# EAGLE design cyberspace-1-rom-programmer (EAGLE 9.6.2)
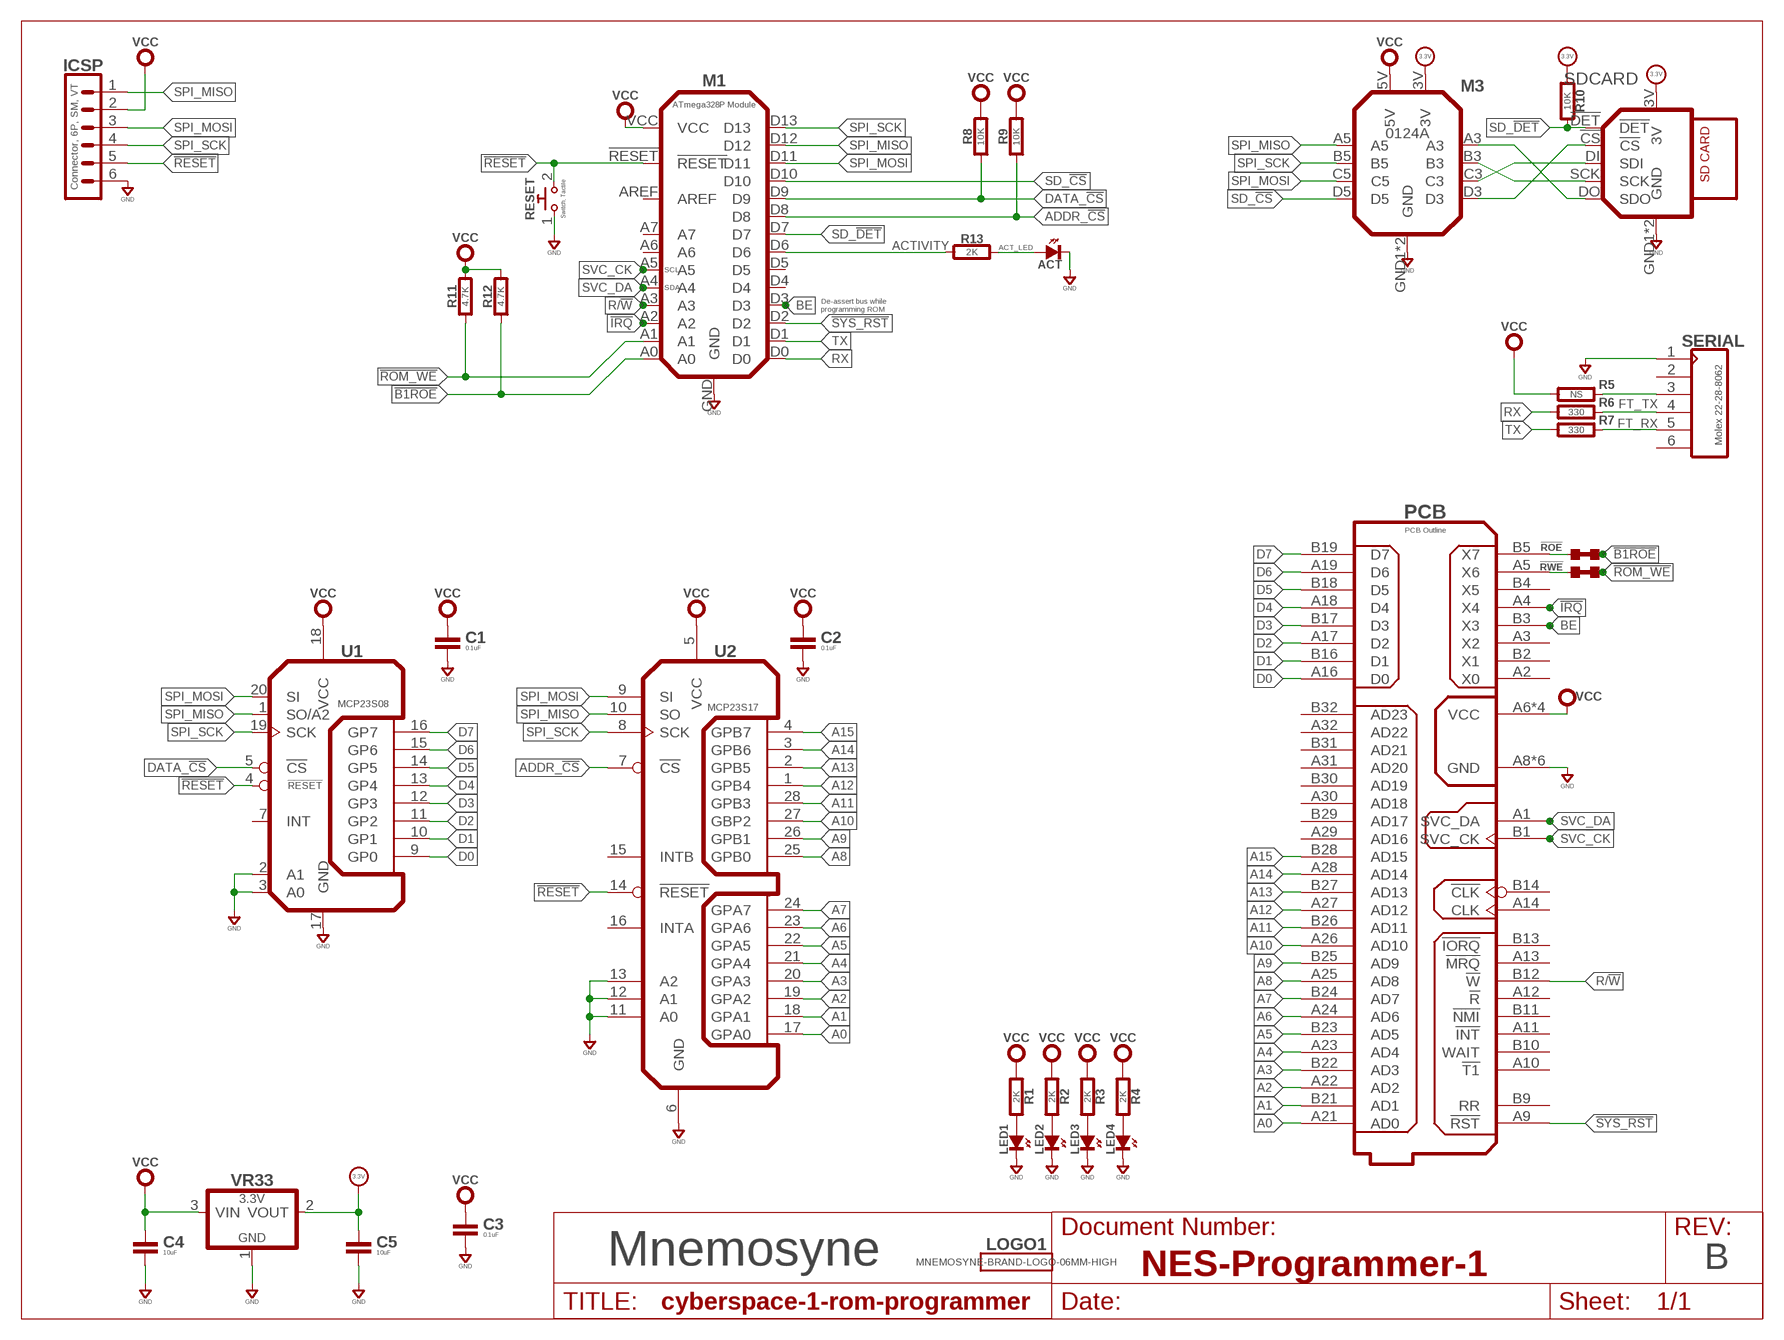
[diagram p0: schematic, sheet 1]
FRAME1 (LETTER_L): DOCUMENT_NUMBER: NES-Programmer-1; REV: B

## Parts
!ROE  NP  SHORT0603  [0603-SHORT]
!RWE  NP  SHORT0603  [0603-SHORT]
ACT  SMT0603  [SMD_0603]
C1  0.1uF  CAPACITOR0603  [0603-CAP]
C2  0.1uF  CAPACITOR0603  [0603-CAP]
C3  0.1uF  CAPACITOR0603  [0603-CAP]
C4  10uF  CAPACITOR0603  [0603-CAP]
C5  10uF  CAPACITOR0603  [0603-CAP]
ICSP  Connector, 6P, SM, VT  06P-SM-VT-SMT  [BM06B-SRSS-TB]
LED1  SMT0603  [SMD_0603]
LED2  SMT0603  [SMD_0603]
LED3  SMT0603  [SMD_0603]
LED4  SMT0603  [SMD_0603]
LOGO1  MNEMOSYNE-BRAND-LOGO-06MM-HIGH  [MNEMOSYNE-06MM]
M1  ATmega328P Module  0119REV-A  [0119A]
M3  0124A  0124REV-A  [0124A]
PCB  PCB Outline  CYBERSPACE-1-CARD-1A  [CYBERSPACE-CARD-TYPE-1A]
R1  2K  RESISTOR0603  [0603-RES]
R2  2K  RESISTOR0603  [0603-RES]
R3  2K  RESISTOR0603  [0603-RES]
R4  2K  RESISTOR0603  [0603-RES]
R5  NS  RESISTOR0603  [0603-RES]
R6  330  RESISTOR0603  [0603-RES]
R7  330  RESISTOR0603  [0603-RES]
R8  10K  RESISTOR0603  [0603-RES]
R9  10K  RESISTOR0603  [0603-RES]
R10  10K  RESISTOR0603  [0603-RES]
R11  4.7K  RESISTOR0603  [0603-RES]
R12  4.7K  RESISTOR0603  [0603-RES]
R13  2K  RESISTOR0603  [0603-RES]
RESET  Switch, Tactile  TACTILESPST-RA-6X6  [TC-0202]
SDCARD  0127REV-A  [0127A]
SERIAL  Molex 22-28-8062  CON_06X1-RA  [MA06X1-RA-THD]
U1  MCP23S08  MCP23S08-QFN  [QFN-20]
U2  MCP23S17  MCP23S17-QFN  [QFN-28-6X6]
VR33  3.3V  LDO-3P--3.3V-SOT23  [SOT-23]

## Nets
!B1ROE: !ROE.4 M1.A0 R12.1
!IRQ: M1.A2 PCB.A4(X4)
!RESET: ICSP.5 M1.!RESET RESET.2 U1.4(!RESET) U2.14(!RESET)
!ROM_WE: !RWE.4 M1.A1 R11.1
!SYS_RST: M1.D2 PCB.A9(!RST)
+3.3V: C5.1 M3.3V R10.2 SDCARD.3V VR33.2(VOUT) ; supply symbol labelled 3.3V
A0: PCB.A21(AD0) U2.17(GPA0)
A1: PCB.B21(AD1) U2.18(GPA1)
A2: PCB.A22(AD2) U2.19(GPA2)
A3: PCB.B22(AD3) U2.20(GPA3)
A4: PCB.A23(AD4) U2.21(GPA4)
A5: PCB.B23(AD5) U2.22(GPA5)
A6: PCB.A24(AD6) U2.23(GPA6)
A7: PCB.B24(AD7) U2.24(GPA7)
A8: PCB.A25(AD8) U2.25(GPB0)
A9: PCB.B25(AD9) U2.26(GPB1)
A10: PCB.A26(AD10) U2.27(GBP2)
A11: PCB.B26(AD11) U2.28(GPB3)
A12: PCB.A27(AD12) U2.1(GPB4)
A13: PCB.B27(AD13) U2.2(GPB5)
A14: PCB.A28(AD14) U2.3(GPB6)
A15: PCB.B28(AD15) U2.4(GPB7)
ACT_LED: ACT.A R13.2
ACTIVITY: M1.D6 R13.1
ADDR_!CS: M1.D8 R9.1 U2.7(!CS)
BE: M1.D3 PCB.B3(X3)
D0: PCB.A16(D0) U1.9(GP0)
D1: PCB.B16(D1) U1.10(GP1)
D2: PCB.A17(D2) U1.11(GP2)
D3: PCB.B17(D3) U1.12(GP3)
D4: PCB.A18(D4) U1.13(GP4)
D5: PCB.B18(D5) U1.14(GP5)
D6: PCB.A19(D6) U1.15(GP6)
D7: PCB.B19(D7) U1.16(GP7)
DATA_!CS: M1.D9 R8.1 U1.5(!CS)
FT_RX: R7.1 SERIAL.5
FT_TX: R6.1 SERIAL.4
GND: ACT.K(C) C1.2 C2.2 C3.2 C4.2 C5.2 ICSP.6 LED1.K(C) LED2.K(C) LED3.K(C) LED4.K(C) M1.GND M3.GND1(GND) M3.GND2(GND) PCB.A8(GND) PCB.A15(GND) PCB.A20(GND) PCB.B8(GND) PCB.B15(GND) PCB.B20(GND) RESET.1 SDCARD.GND1(GND) SDCARD.GND2(GND) SERIAL.1 U1.2(A1) U1.3(A0) U1.17(GND) U2.6(GND) U2.11(A0) U2.12(A1) U2.13(A2) VR33.1(GND)
N$1: M3.A3 SDCARD.DO(SDO)
N$2: M3.B3 SDCARD.SCK
N$3: M3.C3 SDCARD.DI(SDI)
N$4: R5.1 SERIAL.3
N$5: M3.D3 SDCARD.!CS
N$6: LED1.A R1.2
N$7: LED2.A R2.2
N$8: LED3.A R3.2
N$9: !ROE.3 PCB.B5(X7)
N$10: !RWE.3 PCB.A5(X6)
N$11: LED4.A R4.2
R/!W: M1.A3 PCB.B12(!W)
RX: M1.D0 R6.2
SD_!CS: M1.D10 M3.D5
SD_!DET: M1.D7 R10.1 SDCARD.!DET
SPI_MISO: ICSP.1 M1.D12 M3.A5 U1.1(SO/A2) U2.10(SO)
SPI_MOSI: ICSP.3 M1.D11 M3.C5 U1.20(SI) U2.9(SI)
SPI_SCK: ICSP.4 M1.D13 M3.B5 U1.19(SCK) U2.8(SCK)
SVC_CK: M1.A5 PCB.B1(SVC_CK)
SVC_DA: M1.A4 PCB.A1(SVC_DA)
TX: M1.D1 R7.2
VCC: C1.1 C2.1 C3.1 C4.1 ICSP.2 M1.VCC M3.5V PCB.A6(VCC) PCB.A7(VCC) PCB.B6(VCC) PCB.B7(VCC) R1.1 R2.1 R3.1 R4.1 R5.2 R8.2 R9.2 R11.2 R12.2 U1.18(VCC) U2.5(VCC) VR33.3(VIN)
Unconnected: M1.A6 M1.A7 M1.AREF M1.D4 M1.D5 PCB.A2(X0) PCB.A3(X2) PCB.A10(!T1) PCB.A11(!INT) PCB.A12(!R) PCB.A13(!MRQ) PCB.A14(CLK) PCB.A29(AD16) PCB.A30(AD18) PCB.A31(AD20) PCB.A32(AD22) PCB.B2(X1) PCB.B4(X5) PCB.B9(RR) PCB.B10(WAIT) PCB.B11(!NMI) PCB.B13(!IORQ) PCB.B14(!CLK) PCB.B29(AD17) PCB.B30(AD19) PCB.B31(AD21) PCB.B32(AD23) SERIAL.2 SERIAL.6 U1.7(INT) U2.15(INTB) U2.16(INTA)

## Notes on the sheet
- SCL
- SDA
- De-assert bus while 
  programming ROM
- Mnemosyne

## Library data of the parts
!ROE !RWE = rlc:SHORT: Pre-shorted SMT Resistor Pad
ACT LED1-LED4 = led:SMT: LED SMT; COST01: 0.20; COST10: 0.17; COST100: 0.14
C1-C5 = rlc:CAPACITOR: Capacitor; COST01: 0.12; COST10: 0.09; COST100: 0.05
ICSP = con-jst:06P: Connector, 6P; COST01: 0.60; COST10: 0.52; COST100: 0.49; MFR: JST; MPN: BM06-SRSS-TB
LOGO1 = gfx-glyphs:MNEMOSYNE-BRAND-LOGO: Mnemosyne Brand Logo
M1 = circuit-monkey-chips:0119: Circuit Monkey #0119 - ATmega328P Module; COST01: 18.38; COST10: 13.22; COST100: 9.09; MFR: Circuit Monkey; MPN: 0119A
M3 = circuit-monkey-chips:0124: Logic Level Translator; COST01: 5.17; COST10: 3.60; COST100: 1.86; MFR: Circuit Monkey; MPN: 0124A
PCB = con-edge:CYBERSPACE-1-CARD: Card for the CyberSpace 1 System
R1-R13 = rlc:RESISTOR: Resistor; COST01: 0.10; COST10: 0.05; COST100: 0.02
RESET = switch-thd:TACTILE: Push Sw.; COST01: 0.20; COST10: 0.16; COST100: 0.13; MFR: CUI; MPN: TS11-674-xx; MPN2: Tayda/A-5134
SDCARD = circuit-monkey-chips:0127: 0127 SD Card Micro; COST01: 8.23; COST10: 5.24; COST100: 4.02; MFR: Circuit Monkey; MPN: 0127
SERIAL = con-headers:CON_06X1: Header, 6-pin, single row; COST01: 0.30; COST10: 0.20; COST100: 0.10
U1 = co-microchip:MCP23S08: Microchip 8-bit SPI I/O Expander; COST01: 1.65; COST10: 1.65; COST100: 1.32; MFR: Microchip; MPN: MCP23S08-E/ML
U2 = co-microchip:MCP23S17: 16-Bit I/O Expander with SPI Interface; COST01: 2.20; COST10: 2.10; COST100: 1.70; MFR: Microchip; MPN: MCP23S17-x/ML
VR33 = regulators:LDO-3P-: regulator 3-pin; COST01: 0.76; COST10: 0.66; COST100: 0.55; MPN: AP2120N-3.3; MPN2: XC6206P332MR-G; MPN3: AP7387-33SA; SEEED: 310030099

## Board
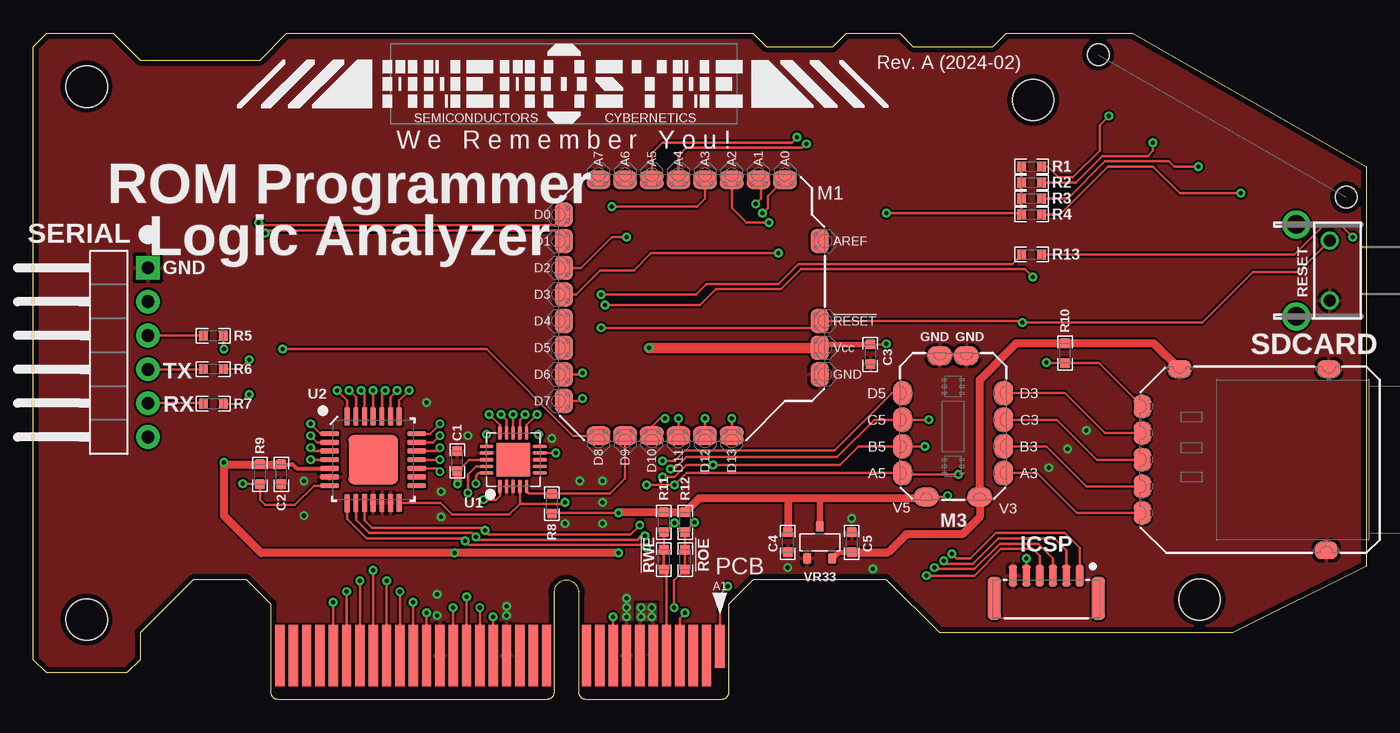
[diagram p1: board, top side]
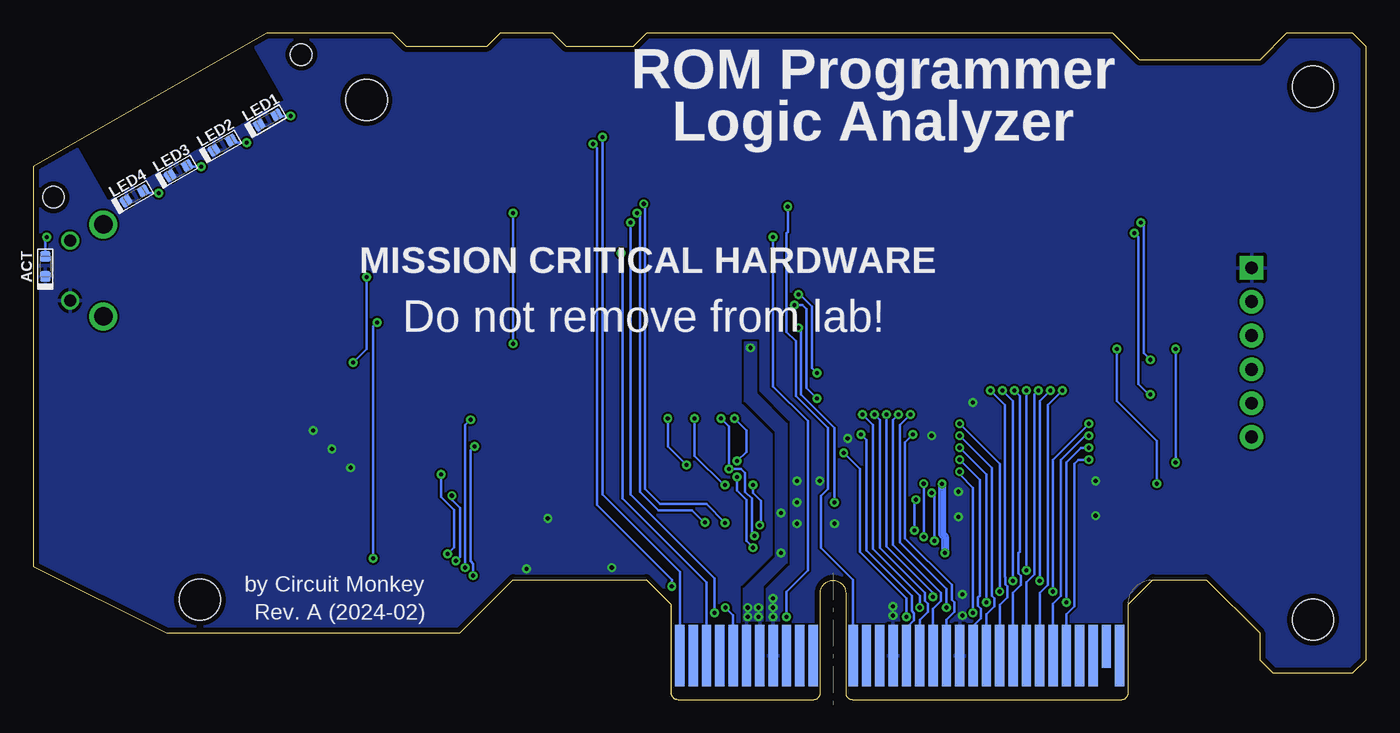
[diagram p2: board, bottom side, seen from below]

Size 100 x 50 mm. Coordinates in mm from the lower left corner, seen from the top.
Copper layers (1*16): Top 0.0356mm / dielectric 1.5011mm / Bottom 0.0356mm
Design rules "OSH-CircuitMonkey": minimum track width 6mil, minimum drill 12mil, track to track 6mil, track to pad 6mil, pad to pad 6mil, via to via 6mil, smd to smd 6mil, copper to edge 15mil, drill to drill 6mil, minimum pad ring 7mil, minimum via ring 7mil, stop-mask expansion 3mil, vias tented up to drill 13mil, thermal gap 10mil
Holes 1.6 mm at 79.9,48.4 98.5,37.7
bRestrict: area 81.3,37.6 to 96.6,48.9

### Footprints (pad centres in the part's own frame; a part is rotated, then mirrored left to right if it is on the bottom)
0603-SHORT = smd 0.711 x 0.762: 3 -0.752,0; 4 0.752,0
SMD_0603 = smd 0.8 x 0.8: A 0.75,0; K -0.75,0
0603-CAP = smd 0.711 x 0.762: 1 -0.752,0; 2 0.752,0
BM06B-SRSS-TB = smd 0.6 x 1.6: 1 -2.5,-0.3; 2 -1.5,-0.3; 3 -0.5,-0.3; 4 0.5,-0.3; 5 1.5,-0.3; 6 2.5,-0.3 | smd 1 x 3.2: MTG1 3.9,1.4; MTG2 -3.9,1.4
0119A = smd 1.4 x 1.8: !RESET 9.6,-1; AREF 9.6,5; D0 -9.6,7; D1 -9.6,5; D2 -9.6,3; D3 -9.6,1; D4 -9.6,-1; D5 -9.6,-3; D6 -9.6,-5; D7 -9.6,-7; GND 9.6,-5; VCC 9.6,-3 | smd 1.8 x 1.4: A0 7,9.6; A1 5,9.6; A2 3,9.6; A3 1,9.6; A4 -1,9.6; A5 -3,9.6; A6 -5,9.6; A7 -7,9.6; D8 -7,-9.6; D9 -5,-9.6; D10 -3,-9.6; D11 -1,-9.6; D12 1,-9.6; D13 3,-9.6
0124A = smd 1.8 x 1.4: 3V -2,5.3; 5V 2,5.3; GND1 -1,-5.3; GND2 1,-5.3 | smd 1.4 x 1.8: A3 -3.8,3.5; A5 3.8,3.5; B3 -3.8,1.5; B5 3.8,1.5; C3 -3.8,-0.5; C5 3.8,-0.5; D3 -3.8,-2.5; D5 3.8,-2.5
CYBERSPACE-CARD-TYPE-1A = smd 0.7 x 3.2: A1 11.5,4 | smd 0.7 x 4.6: A2 10.5,3.3; A3 9.5,3.3; A4 8.5,3.3; A5 7.5,3.3; A6 6.5,3.3; A7 5.5,3.3; A8 4.5,3.3; A9 3.5,3.3; A10 2.5,3.3; A11 1.5,3.3; A12 -1.5,3.3; A13 -2.5,3.3; A14 -3.5,3.3; A15 -4.5,3.3; A16 -5.5,3.3; A17 -6.5,3.3; A18 -7.5,3.3; A19 -8.5,3.3; A20 -9.5,3.3; A21 -10.5,3.3; A22 -11.5,3.3; A23 -12.5,3.3; A24 -13.5,3.3; A25 -14.5,3.3; A26 -15.5,3.3; A27 -16.5,3.3; A28 -17.5,3.3; A29 -18.5,3.3; A30 -19.5,3.3; A31 -20.5,3.3; A32 -21.5,3.3 | smd 0.7 x 4.6 bottom: B1 11.5,3.3; B2 10.5,3.3; B3 9.5,3.3; B4 8.5,3.3; B5 7.5,3.3; B6 6.5,3.3; B7 5.5,3.3; B8 4.5,3.3; B9 3.5,3.3; B10 2.5,3.3; B11 1.5,3.3; B12 -1.5,3.3; B13 -2.5,3.3; B14 -3.5,3.3; B15 -4.5,3.3; B16 -5.5,3.3; B17 -6.5,3.3; B18 -7.5,3.3; B19 -8.5,3.3; B20 -9.5,3.3; B21 -10.5,3.3; B22 -11.5,3.3; B23 -12.5,3.3; B24 -13.5,3.3; B25 -14.5,3.3; B26 -15.5,3.3; B27 -16.5,3.3; B28 -17.5,3.3; B29 -18.5,3.3; B30 -19.5,3.3; B32 -21.5,3.3 | smd 0.7 x 3.2 bottom: B31 -20.5,4 | hole 3.1: -36,46; -36,6; 47.5,7.5; 35,45
0603-RES = smd 0.711 x 0.762: 1 -0.752,0; 2 0.752,0
TC-0202 = drill 0.9: 1 -2.25,2.35; 2 2.25,2.35 | drill 1.4: MT1 -3.45,4.85; MT2 3.45,4.85
0127A = smd 1.7 x 1.3: 3V -6,6.8; GND1 5.2,6.8; GND2 5,-6.8 | smd 1.3 x 1.7: !CS -8.8,2; !DET -8.8,4; DI -8.8,0; DO -8.8,-4; SCK -8.8,-2
MA06X1-RA-THD = drill 0.965 pad 1.778 square: 1 0,0 | drill 0.965 pad 1.778: 2 2.54,0; 3 5.08,0; 4 7.62,0; 5 10.16,0; 6 12.7,0
QFN-20 = smd 1 x 0.25: 1 -2,1; 2 -2,0.5; 3 -2,0; 4 -2,-0.5; 5 -2,-1; 11 2,-1; 12 2,-0.5; 13 2,0; 14 2,0.5; 15 2,1 | smd 0.25 x 1: 6 -1,-2; 7 -0.5,-2; 8 0,-2; 9 0.5,-2; 10 1,-2; 16 1,2; 17 0.5,2; 18 0,2; 19 -0.5,2; 20 -1,2 | smd 2.5 x 2.5: PAD 0,0
QFN-28-6X6 = smd 3.7 x 3.7: 0 0,0 | smd 1.4 x 0.4: 1 -3.258,1.95; 2 -3.258,1.3; 3 -3.258,0.65; 4 -3.258,0; 5 -3.258,-0.65; 6 -3.258,-1.3; 7 -3.258,-1.95; 15 3.258,-1.95; 16 3.258,-1.3; 17 3.258,-0.65; 18 3.258,0; 19 3.258,0.65; 20 3.258,1.3; 21 3.258,1.95 | smd 0.4 x 1.4: 8 -1.95,-3.279; 9 -1.3,-3.258; 10 -0.65,-3.258; 11 0,-3.258; 12 0.65,-3.258; 13 1.3,-3.258; 14 1.95,-3.258; 22 1.95,3.258; 23 1.3,3.258; 24 0.65,3.258; 25 0,3.258; 26 -0.65,3.258; 27 -1.3,3.258; 28 -1.95,3.258
SOT-23 = smd 0.6 x 0.8: 1 0.95,1.2; 2 -0.95,1.2; 3 0,-1.2

### Placement (x,y rotation side)
!ROE  48.9,10.5 90 top
!RWE  47.3,10.5 90 top
ACT  99.1,32.5 90 bottom
C1  31.8,17.9 90 top
C2  18.6,16.9 270 top
C3  62.8,25.9 270 top
C4  56.6,11.8 270 top
C5  61.4,11.8 90 top
ICSP  76,9 180 top
LED1  82.4,43.5 30 bottom
LED2  85.8,41.6 30 bottom
LED3  89.1,39.7 30 bottom
LED4  92.4,37.8 30 bottom
LOGO1  39.8,46.2 0 top
M1  49.4,29.4 0 top
M3  69,20.5 180 top
PCB  40,0 0 top
R1  74.9,40 0 top
R2  74.9,38.8 0 top
R3  74.9,37.6 0 top
R4  74.9,36.4 0 top
R5  13.5,27.3 0 top
R6  13.5,24.8 0 top
R7  13.5,22.2 0 top
R8  38.9,14.7 270 top
R9  17,16.9 90 top
R10  77.4,26 90 top
R11  47.3,13.3 90 top
R12  48.9,13.3 90 top
R13  74.9,33.4 0 top
RESET  99.6,32.2 90 top
SDCARD  92,18 0 top
SERIAL  8.6,32.4 270 top
U1  36,18 90 top
U2  25.5,18 0 top
VR33  59,11.8 180 top

### Tracks (layer width: path | path; a pad name or v marks a point on that pad's centre or on a via)
!B1ROE  (via drill 0.3)
  Top 0.2: M1.A0 56.3,39 55.1,37.8 55.1,36.9 v54.7,36.5 | v49.6,13.3 49.6,13.25 R12.1 !ROE.4
  Bottom 0.2: v54.7,36.5 54.5,36.3 54.5,15.6 53.1,14.2 50.6,14.2 49.7,13.3 v49.6,13.3
!IRQ  (via drill 0.3)
  Top 0.2: PCB.A4 48.5,6.1 v48.9,6.5 | v55.2,35.8 53.5,35.8 52.4,36.9 M1.A2
  Bottom 0.2: v48.9,6.5 48.9,9.1 55.2,15.4 v55.2,35.8
!RESET  (via drill 0.3)
  Top 0.2: ICSP.5 v74.5,10.6 | RESET.2 94.9,32.1 91.5,32.1 87.7,28.3 v74.2,28.3 74.1,28.4 M1.!RESET 58.5,27.9 v42.6,27.9 | U2.14 30.56,14.74 31.4,13.9 35.7,13.9 36.5,14.7 | v39.9,14.8 39.8,14.7 36.5,14.7 | U1.4 36.5,14.7
  Bottom 0.2: v74.2,28.3 74.5,28 v74.5,10.6 | v39.9,14.8 39.9,20.4 42.4,22.9 42.4,27.7 v42.6,27.9
!ROM_WE  (via drill 0.3)
  Top 0.2: M1.A1 54.6,38.8 54.6,37.6 v54.2,37.2 | v48.1,13.25 47.35,12.55 R11.1 !RWE.4
  Bottom 0.2: v54.2,37.2 54.1,37.1 54.1,15.8 53,14.7 49.5,14.7 v48.1,13.25
!SYS_RST  (via drill 0.3)
  Top 0.2: PCB.A9 v43.5,6.2 | M1.D2 41.1,32.4 43.4,34.7 v44.5,34.7
  Bottom 0.2: v43.5,6.2 43.5,8.1 41.9,9.7 41.9,20.9 44.5,23.5 v44.5,34.7
+3.3V
  Top 0.4: VR33.2 60.4,11.05 C5.1
  Top 0.6: C5.1 64.15,11.05 65.5,12.4 69.7,12.4 71,13.7 M3.3V 71,24 73.75,26.75 R10.2 84.05,26.75 SDCARD.3V
A0  (via drill 0.3)
  Top 0.2: PCB.A21 v29.5,6.5 | U2.17 30.25,17.35 v30.5,17.1
  Bottom 0.2: v29.5,6.5 29.5,15.9 30.5,16.9 v30.5,17.1
A1  (via drill 0.3)
  Top 0.2: U2.18 v30.5,18
  Bottom 0.2: v30.5,18 29,16.5 29,7.8 29.15,7.65 29.15,7.05 28.9,6.8 28.9,6.1 29.5,5.5 PCB.B21
A2  (via drill 0.3)
  Top 0.2: PCB.A22 v28.5,7.3 | U2.19 30.25,18.65 v30.5,18.9
  Bottom 0.2: v28.5,7.3 28.5,16.9 v30.5,18.9
A3  (via drill 0.3)
  Top 0.2: U2.20 30,19.3 v30.5,19.8
  Bottom 0.2: PCB.B22 28.5,6.4 27.9,7 27.9,7.6 28.1,7.8 28.1,17.4 v30.5,19.8
A4  (via drill 0.3)
  Top 0.2: PCB.A23 v27.5,8.1 | U2.21 29.75,19.95 v30.5,20.7
  Bottom 0.2: v27.5,8.1 27.5,17.7 v30.5,20.7
A5  (via drill 0.3)
  Top 0.2: U2.22 27.45,22.45 v28.2,23.2
  Bottom 0.2: v28.2,23.2 27.1,22.1 27.1,9.2 27.08,9.18 27.08,8.66 26.92,8.49 26.92,7.68 27.5,7.1 PCB.B23
A6  (via drill 0.3)
  Top 0.2: PCB.A24 v26.5,8.9 | U2.23 26.8,22.7 v27.3,23.2
  Bottom 0.2: v26.5,8.9 26.5,22.4 v27.3,23.2
A7  (via drill 0.3)
  Top 0.2: U2.24 26.15,22.95 v26.4,23.2
  Bottom 0.2: PCB.B24 26.5,8 25.9,8.6 25.9,9.28 26.08,9.46 26.08,10.08 26.1,10.1 26.1,11 26,11.1 26,22.8 v26.4,23.2
A8  (via drill 0.3)
  Top 0.2: PCB.A25 v25.5,9.7 | U2.25 v25.5,23.2
  Bottom 0.2: v25.5,9.7 v25.5,23.2
A9  (via drill 0.3)
  Top 0.2: U2.26 24.85,22.95 v24.6,23.2
  Bottom 0.2: PCB.B25 25.5,8.8 24.9,9.4 24.9,22.9 v24.6,23.2
A10  (via drill 0.3)
  Top 0.2: PCB.A26 v24.5,8.9 | U2.27 24.2,22.7 v23.7,23.2
  Bottom 0.2: v24.5,8.9 24.5,22.4 v23.7,23.2
A11  (via drill 0.3)
  Top 0.2: U2.28 23.55,22.45 v22.8,23.2
  Bottom 0.2: PCB.B26 24.5,8 23.9,8.6 23.9,22.1 v22.8,23.2
A12  (via drill 0.3)
  Top 0.2: PCB.A27 v23.5,8.1 | U2.1 21.55,19.95 v20.8,20.7
  Bottom 0.2: v23.5,8.1 23.5,18 v20.8,20.7
A13  (via drill 0.3)
  Top 0.2: U2.2 21.3,19.3 v20.8,19.8
  Bottom 0.2: PCB.B27 23.5,7.2 22.9,7.8 22.9,18 21.1,19.8 v20.8,19.8
A14  (via drill 0.3)
  Top 0.2: PCB.A28 v22.5,7.3 | U2.3 21.05,18.65 v20.8,18.9
  Bottom 0.2: v22.5,7.3 22.5,17.8 21.4,18.9 v20.8,18.9
A15  (via drill 0.3)
  Top 0.2: U2.4 v20.8,18
  Bottom 0.2: PCB.B28 22.5,6.4 21.9,7 21.9,17.7 21.6,18 v20.8,18
ACT_LED  (via drill 0.3)
  Top 0.2: v99,34.7 98.1,35.6 96.8,35.6 94.6,33.4 R13.2
  Bottom 0.2: ACT.A 99.1,34.6 v99,34.7
ACTIVITY  (via drill 0.3)
  Top 0.2: M1.D6 41.1,24.4 v41.2,24.5 | v42.6,30.4 49.7,30.4 50.5,31.2 55.9,31.2 57.4,32.7 73.45,32.7 R13.1
  Bottom 0.2: v42.6,30.4 42.5,30.4 41.6,29.5 41.6,24.9 v41.2,24.5
ADDR_!CS  (via drill 0.3)
  Top 0.2: M1.D8 40.5,19.8 34,26.3 v18.7,26.3 | v15.7,16.2 16.95,16.2 R9.1 17,15 17.4,14.6 19.6,14.6 21.05,16.05 U2.7
  Bottom 0.2: v18.7,26.3 18.7,22.4 15.7,19.4 v15.7,16.2
BE  (via drill 0.3)
  Top 0.2: v55.9,33.5 46.35,33.5 45.05,32.2 42.5,32.2 40.7,30.4 M1.D3
  Bottom 0.2: PCB.B3 49.5,8.8 55.8,15.1 55.8,33.4 v55.9,33.5
D0  (via drill 0.3)
  Top 0.2: PCB.A16 v34.5,6.2 | U1.9 v39.2,18.5
  Bottom 0.2: v34.5,6.2 34.5,7.6 38,11.1 38,17.3 v39.2,18.5
D1  (via drill 0.3)
  Top 0.2: v37.9,19.9 38,19.8 U1.10
  Bottom 0.2: PCB.B16 34.5,5.38 33.92,5.96 33.92,6.47 34.1,6.65 34.1,7.8 37.5,11.2 37.5,19.5 v37.9,19.9
D2  (via drill 0.3)
  Top 0.2: PCB.A17 v33.5,6.9 | U1.11 37,20.6 v37.8,21.4
  Bottom 0.2: v33.5,6.9 33.5,7.8 37,11.3 37,20.6 v37.8,21.4
D3  (via drill 0.3)
  Top 0.2: U1.12 36.5,21 v36.9,21.4
  Bottom 0.2: PCB.B17 33.5,6 32.9,6.6 32.9,7.2 33.1,7.4 33.1,8 36.5,11.4 36.5,20.98 36.9,21.38 v36.9,21.4
D4  (via drill 0.3)
  Top 0.2: PCB.A18 v32.5,7.7 | U1.13 v36,21.4
  Bottom 0.2: v32.5,7.7 32.5,8 36,11.5 v36,21.4
D5  (via drill 0.3)
  Top 0.2: U1.14 35.5,21 v35.1,21.4
  Bottom 0.2: PCB.B18 32.5,6.8 31.9,7.4 31.9,8 35.5,11.6 35.5,21 v35.1,21.4
D6  (via drill 0.3)
  Top 0.2: PCB.A19 v31.5,6.9 | U1.15 35,20.6 v34.2,21.4
  Bottom 0.2: v34.2,21.4 35,20.6 35,11.8 31.5,8.3 v31.5,6.9
D7  (via drill 0.3)
  Top 0.2: v34,19.9 U1.16
  Bottom 0.2: PCB.B19 31.5,6 30.9,6.6 30.9,7.3 31.1,7.5 31.1,8.6 34.6,12.1 34.6,19.3 v34,19.9
DATA_!CS
  Top 0.2: M1.D9 44.4,16.6 43.25,15.45 R8.1 37.15,15.45 37,15.6 U1.5
FT_RX
  Top 0.2: SERIAL.5 12.71,22.24 R7.1
FT_TX
  Top 0.2: SERIAL.4 12.73,24.78 R6.1
GND  (via drill 0.3)
  other vias: 30.3,6.3 30.3,7.9 44.5,6.2 44.5,6.9 44.5,7.6 20.3,16.4 79,20.2 77.6,18.8 76.2,17.4 38.9,19.6 41,16.4 30.6,15.6 30.6,13.7 32.6,19.8 29.5,22.3 20.3,13.8 35.5,6.3 35.5,7 39.9,13.2 42.7,13.2 42.7,14.8 42.7,16.4 56.6,9.9 61.4,13.6 63,9.8
  pour Top (rank 5): 0,2 0,50 100,50 100,2
  pour Bottom (rank 5): 0,2 0,50 100,50 100,2
  pour Top: 81.32,45 94.33,37.57 96.55,41.47 83.54,48.9
N$1
  Top 0.2: M3.A3 75.3,17 78.3,14 SDCARD.DO
N$2
  Top 0.2: M3.B3 76,19 79,16 SDCARD.SCK
N$3
  Top 0.2: M3.C3 76.8,21 79.8,18 SDCARD.DI
N$4
  Top 0.2: SERIAL.3 12.73,27.32 R5.1
N$5
  Top 0.2: M3.D3 77.4,23 80.4,20 SDCARD.!CS
N$6  (via drill 0.3)
  Top 0.2: R1.2 76.1,40 76.9,39.2 78,39.2 80,41.2 80,43.1 v80.7,43.8
  Bottom 0.2: v80.7,43.8 81.38,43.8 81.45,43.88 LED1.A
N$7  (via drill 0.3)
  Top 0.2: R2.2 78.2,38.8 80.2,40.8 83.6,40.8 84,41.2 v84,41.8
  Bottom 0.2: v84,41.8 84.97,41.8 LED2.A
N$8  (via drill 0.3)
  Top 0.2: R3.2 77.6,37.6 80.4,40.4 85.2,40.4 85.6,40 v87.4,40
  Bottom 0.2: v87.4,40 88.38,40 LED3.A
N$9  (via drill 0.3)
  Top 0.2: !ROE.3 48.08,8.93 v48.08,6.9
  Bottom 0.2: v48.08,6.9 47.5,6.32 PCB.B5
N$10
  Top 0.2: !RWE.3 47.5,9.55 PCB.A5
N$11  (via drill 0.3)
  Top 0.2: R4.2 77,36.4 80.6,40 84,40 86,38 v90.6,38
  Bottom 0.2: v90.6,38 91.58,38 LED4.A
R/!W  (via drill 0.3)
  Top 0.2: v43.4,37 49.8,37 50.4,37.6 M1.A3
  Bottom 0.2: PCB.B12 38.5,9 40.9,11.4 40.9,15.3 40.4,15.8 40.4,20.4 42.8,22.8 42.8,26.9 43.5,27.6 43.5,35 43.4,35.1 v43.4,37
RX  (via drill 0.3)
  Top 0.2: v16.2,25.5 16.15,25.5 15.45,24.8 R6.2 | M1.D0 39.8,36.3 39.1,35.6 17.1,35.6 v16.9,35.8
  Bottom 0.2: v16.2,25.5 16.7,26 16.7,35.6 v16.9,35.8
SD_!CS  (via drill 0.3)
  Top 0.2: v47.4,21.1 47,21.1 46.4,20.5 M1.D10 | M3.D5 64.4,23 60.1,18.7 48.9,18.7 48.1,17.9 v47.2,17.9
  Bottom 0.2: v47.4,21.1 46.5,20.2 46.5,18.6 v47.2,17.9
SD_!DET  (via drill 0.3)
  Top 0.2: M1.D7 41,22.4 v41.2,22.6 | v76,25.3 76.05,25.25 R10.1 79.95,25.25 SDCARD.!DET | v42.9,29.6 50,29.6 51.2,30.8 56.1,30.8 57.6,32.3 74.4,32.3 v75,31.7
  Bottom 0.2: v75,31.7 75,26.3 v76,25.3 | v42.9,29.6 42.3,29.6 42,29.3 42,23.4 v41.2,22.6
SPI_MISO  (via drill 0.3)
  Top 0.2: v46,16.1 v48.1,16.1 49,17 M3.A5 65.1,16.9 v69.4,16.9 | v50.4,21.1 M1.D12 | U2.10 24.85,13.45 25.4,12.9 33.68,12.9 v33.88,12.7 33.88,12.62 34.1,12.4 44.82,12.4 v45.5,13.08 | U1.1 35,15.3 34.7,15 v33.78,15 | ICSP.1 78.5,11.4 77.4,12.5 72.2,12.5 70.3,10.6 69.25,10.6 v68.92,10.93
  Bottom 0.2: v48.1,16.1 48.2,16.1 50.4,18.3 v50.4,21.1 | v46,16.1 46,15.5 45.4,14.9 45.4,13.18 v45.5,13.08 | v33.78,15 33.88,15 v33.88,12.7 | v68.92,10.93 68.42,11.43 68.42,14.22 69.4,15.2 v69.4,16.9
SPI_MOSI  (via drill 0.3)
  Top 0.2: v47.8,17.3 48.1,17.3 49,18.2 60.3,18.2 63.1,21 M3.C5 v67.2,21 | v48.4,21.1 M1.D11 | U2.9 24.2,13.5 25.2,12.5 32.9,12.5 v33.2,12.2 33.4,12 45.32,12 45.6,12.28 v45.9,12.28 | U1.20 33.4,17 33.2,16.8 v33.2,16.2 | ICSP.3 76.5,10.6 75.4,11.7 72.5,11.7 70.6,9.8 67.7,9.8 v67.6,9.9
  Bottom 0.2: v48.4,21.1 47.8,20.5 v47.8,17.3 46.9,17.3 46.6,17 46.6,15.6 46.1,15.1 46.1,12.48 v45.9,12.28 | v33.2,16.2 v33.2,12.2 | v67.6,9.9 67.6,20.6 v67.2,21
SPI_SCK  (via drill 0.3)
  Top 0.2: v47.2,16.7 48.1,16.7 49,17.6 v51,17.6 60.5,17.6 61.9,19 M3.B5 v66.9,19 | v52.4,21.1 M1.D13 | U2.8 23.55,13.55 25,12.1 32.2,12.1 v32.4,11.9 32.7,11.6 45.8,11.6 v46,11.4 | U1.19 33.2,17.5 32.6,16.9 v32.6,15.5 | ICSP.4 75.5,10.8 75,11.3 72.6,11.3 70.6,9.3 v67,9.3
  Bottom 0.2: v52.4,21.1 52.4,19 v51,17.6 | v47.2,16.7 47.2,15.7 46.5,15 46.5,11.9 v46,11.4 | v32.6,15.5 32.4,15.3 v32.4,11.9 | v66.9,19 67.2,18.7 67.2,10.4 67,10.2 v67,9.3
SVC_CK  (via drill 0.3)
  Top 0.2: v57.3,42.2 56.9,41.8 47.2,41.8 46.4,41 M1.A5
  Bottom 0.2: PCB.B1 51.5,9.6 57.3,15.4 v57.3,42.2
SVC_DA  (via drill 0.3)
  Top 0.2: PCB.A1 51.5,7.9 v52.1,8.5 | v58,41.7 57.72,41.42 49.02,41.42 48.4,40.8 M1.A4
  Bottom 0.2: v52.1,8.5 52.1,9 57.7,14.6 57.7,41.4 v58,41.7
TX  (via drill 0.3)
  Top 0.2: v16.2,22.9 16.15,22.9 15.45,22.2 R7.2 | v17.4,35 17.6,35.2 39.1,35.2 39.8,34.5 M1.D1
  Bottom 0.2: v16.2,22.9 16.3,22.9 17.1,23.7 17.1,34.7 v17.4,35
VCC  (via drill 0.3)
  Top 0.2: ICSP.2 77.5,11.2 76.6,12.1 72.4,12.1 70.5,10.2 68.5,10.2 v68.3,10.4 | v68.6,15.3 68.5,15.2 M3.5V | 31.82,17.13 32.69,18 U1.18 | R5.2 14.25,26.35 v14.3,26.3 | R8.2 38.95,14 v43.9,14 | C3.1 63.95,26.65 v64,26.7 | v64,36.5 74.05,36.5 R4.1 R3.1 R2.1 R1.1
  Top 0.3: C2.1 19.45,17.65 19.75,17.35 U2.5
  Top 0.4: C3.1 59.25,26.65 M1.VCC
  Top 0.5: VR33.3 59,15.1
  Top 0.6: M3.5V 66.9,15.1 59,15.1 56.6,15.1 | 56.6,15.1 49.95,15.1 R12.2 R11.2 43.9,14.05 v43.9,14 | C1.1 31.82,17.13 v31.82,16.18 | 56.6,15.1 C4.1 | C2.1 R9.2 14.45,17.65 v14.3,17.8 14.3,13.8 17.1,11 v31.6,11 v43.9,11
  Top 0.8: M1.VCC v46.2,26.4
  Bottom 0.2: v68.3,10.4 68,10.7 68,14.4 68.6,15 v68.6,15.3 | v14.3,26.3 v14.3,17.8 | v64,26.7 v64,36.5
  Bottom 0.6: v46.2,26.4 46.3,26.4 | v31.82,16.18 31.82,12.42 31.62,12.22 31.62,11.02 v31.6,11
  other vias: 45.6,6.2 46.4,6.2 46.4,6.9 45.6,6.9
  pour Bottom: 45.8,26.8 45.8,23 43.5,20.7 43.5,10.3 45.3,8.5 45.3,3.8 46.7,3.8 46.7,8.3 44.3,10.7 44.3,20.1 46.6,22.4 46.6,26.8
  pour Top: 45.3,3.4 46.7,3.4 46.7,7.2 45.3,7.2

### Text on the board
tPlace: Rev. A (2024-02) | ROM Programmer / Logic Analyzer | GND | TX | RX
bPlace: ROM Programmer / Logic Analyzer | MISSION CRITICAL HARDWARE | Do not remove from lab! | by Circuit Monkey | Rev. A (2024-02)
tStop: LAB
tRestrict: LAB